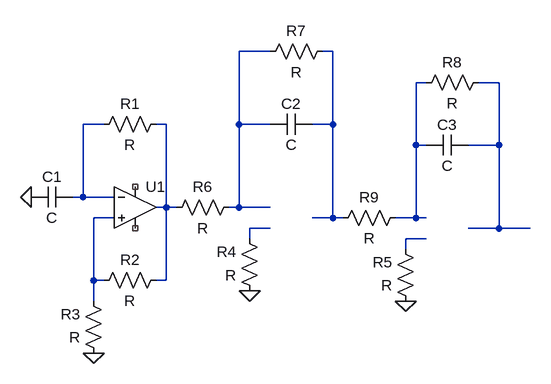
[diagram p0: schematic Draft25.asc]
Draft25.asc, the LTspice schematic file:
Version 4
SHEET 1 880 680
WIRE 368 -336 320 -336
WIRE 464 -336 448 -336
WIRE 608 -288 592 -288
WIRE 720 -288 688 -288
WIRE 112 -224 80 -224
WIRE 208 -224 192 -224
WIRE 320 -224 320 -336
WIRE 368 -224 320 -224
WIRE 464 -224 464 -336
WIRE 464 -224 432 -224
WIRE 592 -192 592 -288
WIRE 608 -192 592 -192
WIRE 720 -192 720 -288
WIRE 720 -192 672 -192
WIRE 80 -112 80 -224
WIRE 80 -112 64 -112
WIRE 128 -112 80 -112
WIRE 208 -96 208 -224
WIRE 208 -96 192 -96
WIRE 224 -96 208 -96
WIRE 320 -96 320 -224
WIRE 320 -96 304 -96
WIRE 368 -96 320 -96
WIRE 128 -80 96 -80
WIRE 464 -80 464 -224
WIRE 464 -80 432 -80
WIRE 480 -80 464 -80
WIRE 592 -80 592 -192
WIRE 592 -80 560 -80
WIRE 608 -80 592 -80
WIRE 368 -64 336 -64
WIRE 720 -64 720 -192
WIRE 720 -64 672 -64
WIRE 768 -64 720 -64
WIRE 336 -48 336 -64
WIRE 608 -48 576 -48
WIRE 576 -32 576 -48
WIRE 96 16 96 -80
WIRE 112 16 96 16
WIRE 208 16 208 -96
WIRE 208 16 192 16
WIRE 96 48 96 16
FLAG 576 48 0
FLAG 336 32 0
FLAG 96 128 0
FLAG 0 -112 0
SYMBOL Opamps/UniversalOpamp2 160 -96 R0
SYMATTR InstName U1
SYMBOL cap 64 -128 R90
WINDOW 0 0 32 VBottom 2
WINDOW 3 32 32 VTop 2
SYMATTR InstName C1
SYMBOL cap 432 -240 R90
WINDOW 0 0 32 VBottom 2
WINDOW 3 32 32 VTop 2
SYMATTR InstName C2
SYMBOL cap 672 -208 R90
WINDOW 0 0 32 VBottom 2
WINDOW 3 32 32 VTop 2
SYMATTR InstName C3
SYMBOL res 208 -240 R90
WINDOW 0 0 56 VBottom 2
WINDOW 3 32 56 VTop 2
SYMATTR InstName R1
SYMBOL res 208 0 R90
WINDOW 0 0 56 VBottom 2
WINDOW 3 32 56 VTop 2
SYMATTR InstName R2
SYMBOL res 112 144 R180
WINDOW 0 36 76 Left 2
WINDOW 3 36 40 Left 2
SYMATTR InstName R3
SYMBOL res 352 48 R180
WINDOW 0 36 76 Left 2
WINDOW 3 36 40 Left 2
SYMATTR InstName R4
SYMBOL res 592 64 R180
WINDOW 0 36 76 Left 2
WINDOW 3 36 40 Left 2
SYMATTR InstName R5
SYMBOL res 208 -80 R270
WINDOW 0 32 56 VTop 2
WINDOW 3 0 56 VBottom 2
SYMATTR InstName R6
SYMBOL res 352 -320 R270
WINDOW 0 32 56 VTop 2
WINDOW 3 0 56 VBottom 2
SYMATTR InstName R7
SYMBOL res 592 -272 R270
WINDOW 0 32 56 VTop 2
WINDOW 3 0 56 VBottom 2
SYMATTR InstName R8
SYMBOL res 464 -64 R270
WINDOW 0 32 56 VTop 2
WINDOW 3 0 56 VBottom 2
SYMATTR InstName R9

The netlist it stands for:
* Draft25.asc
XU1 N007 N005 NC_01 NC_02 N006 level.2 Avol=1Meg GBW=10Meg Slew=10Meg ilimit=25m rail=0 Vos=0 phimargin=45 en=0 enk=0 in=0 ink=0 Rin=500Meg  ; pins IN+ IN- V+ V- OUT
C1 N005 0 C
C2 N002 N001 C
C3 N004 N003 C
R1 N006 N005 R
R2 N006 N007 R
R3 0 N007 R
R4 0 N008 R
R5 0 N009 R
R6 N006 N001 R
R7 N001 N002 R
R8 N003 N004 R
R9 N002 N003 R
.lib UniversalOpamps2.sub
.backanno
.end